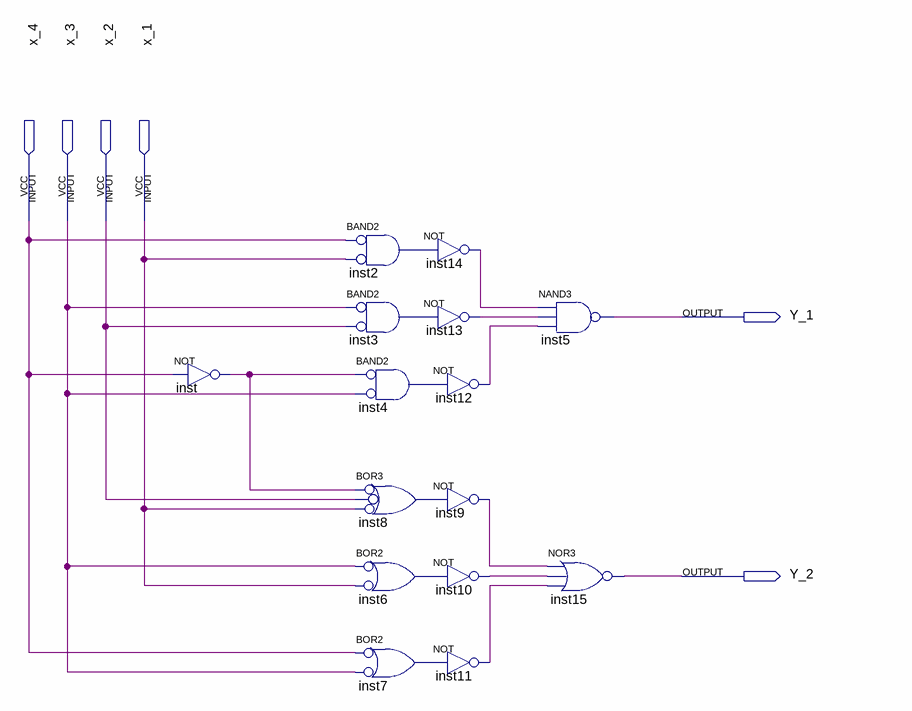
[diagram p0: schematic sheet]
// Quartus schematic Lab1.bdf as structural Verilog: 15 symbols, 6 pins
module Lab1 (
  input  x_4,
  input  x_3,
  input  x_2,
  input  x_1,
  output Y_1,
  output Y_2
);

  wire inst2_out, inst3_out, inst4_out, inst6_out, inst7_out, inst8_out, inst9_out, inst10_out, inst11_out,
       inst12_out, inst13_out, inst14_out, inst_out;

  not inst (inst_out, x_4);
  and inst2 (inst2_out, ~x_4, ~x_1);  // BAND2
  and inst3 (inst3_out, ~x_3, ~x_2);  // BAND2
  and inst4 (inst4_out, ~inst_out, ~x_3);  // BAND2
  or inst8 (inst8_out, ~inst_out, ~x_2, ~x_1);  // BOR3
  or inst6 (inst6_out, ~x_3, ~x_1);  // BOR2
  or inst7 (inst7_out, ~x_4, ~x_3);  // BOR2
  not inst14 (inst14_out, inst2_out);
  not inst13 (inst13_out, inst3_out);
  not inst12 (inst12_out, inst4_out);
  not inst9 (inst9_out, inst8_out);
  not inst10 (inst10_out, inst6_out);
  not inst11 (inst11_out, inst7_out);
  nand inst5 (Y_1, inst14_out, inst13_out, inst12_out);
  nor inst15 (Y_2, inst9_out, inst10_out, inst11_out);
endmodule
